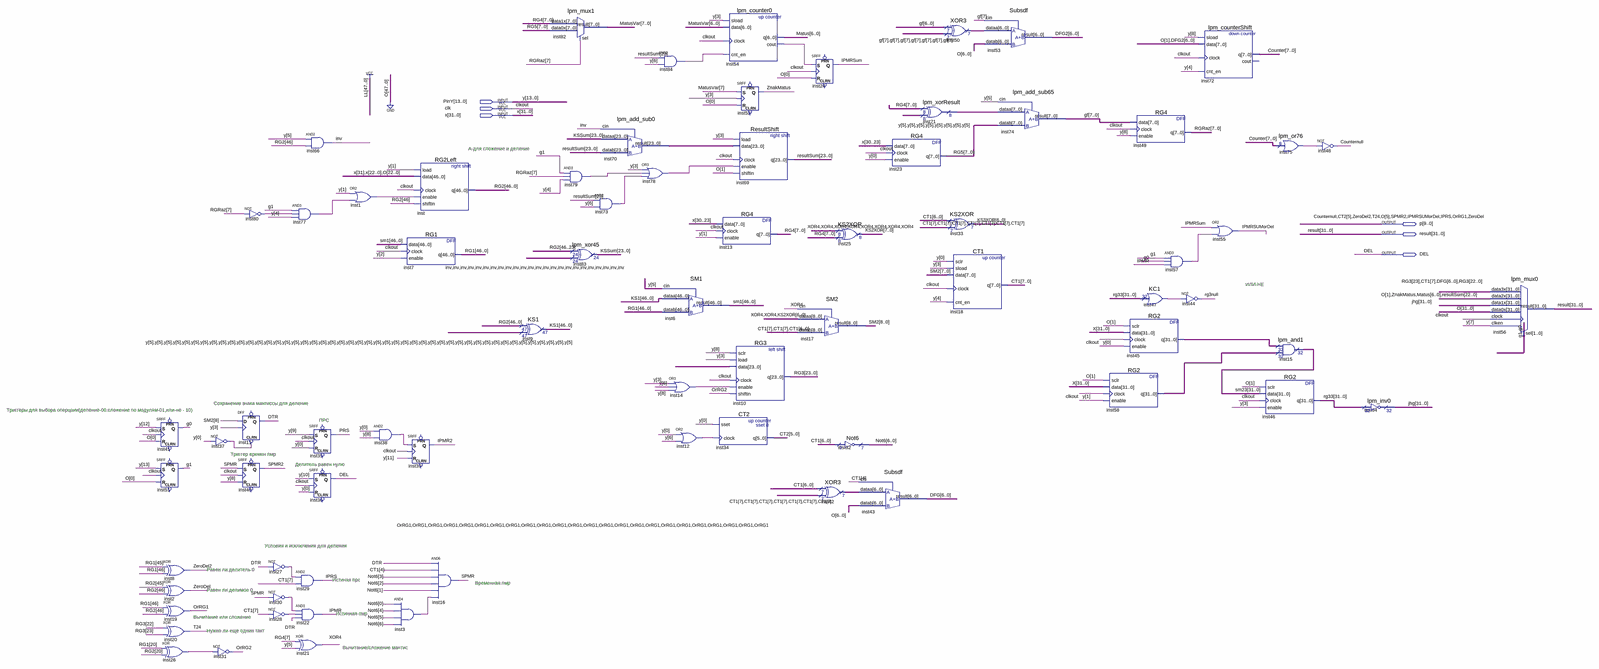
[diagram p0: schematic sheet, whole]
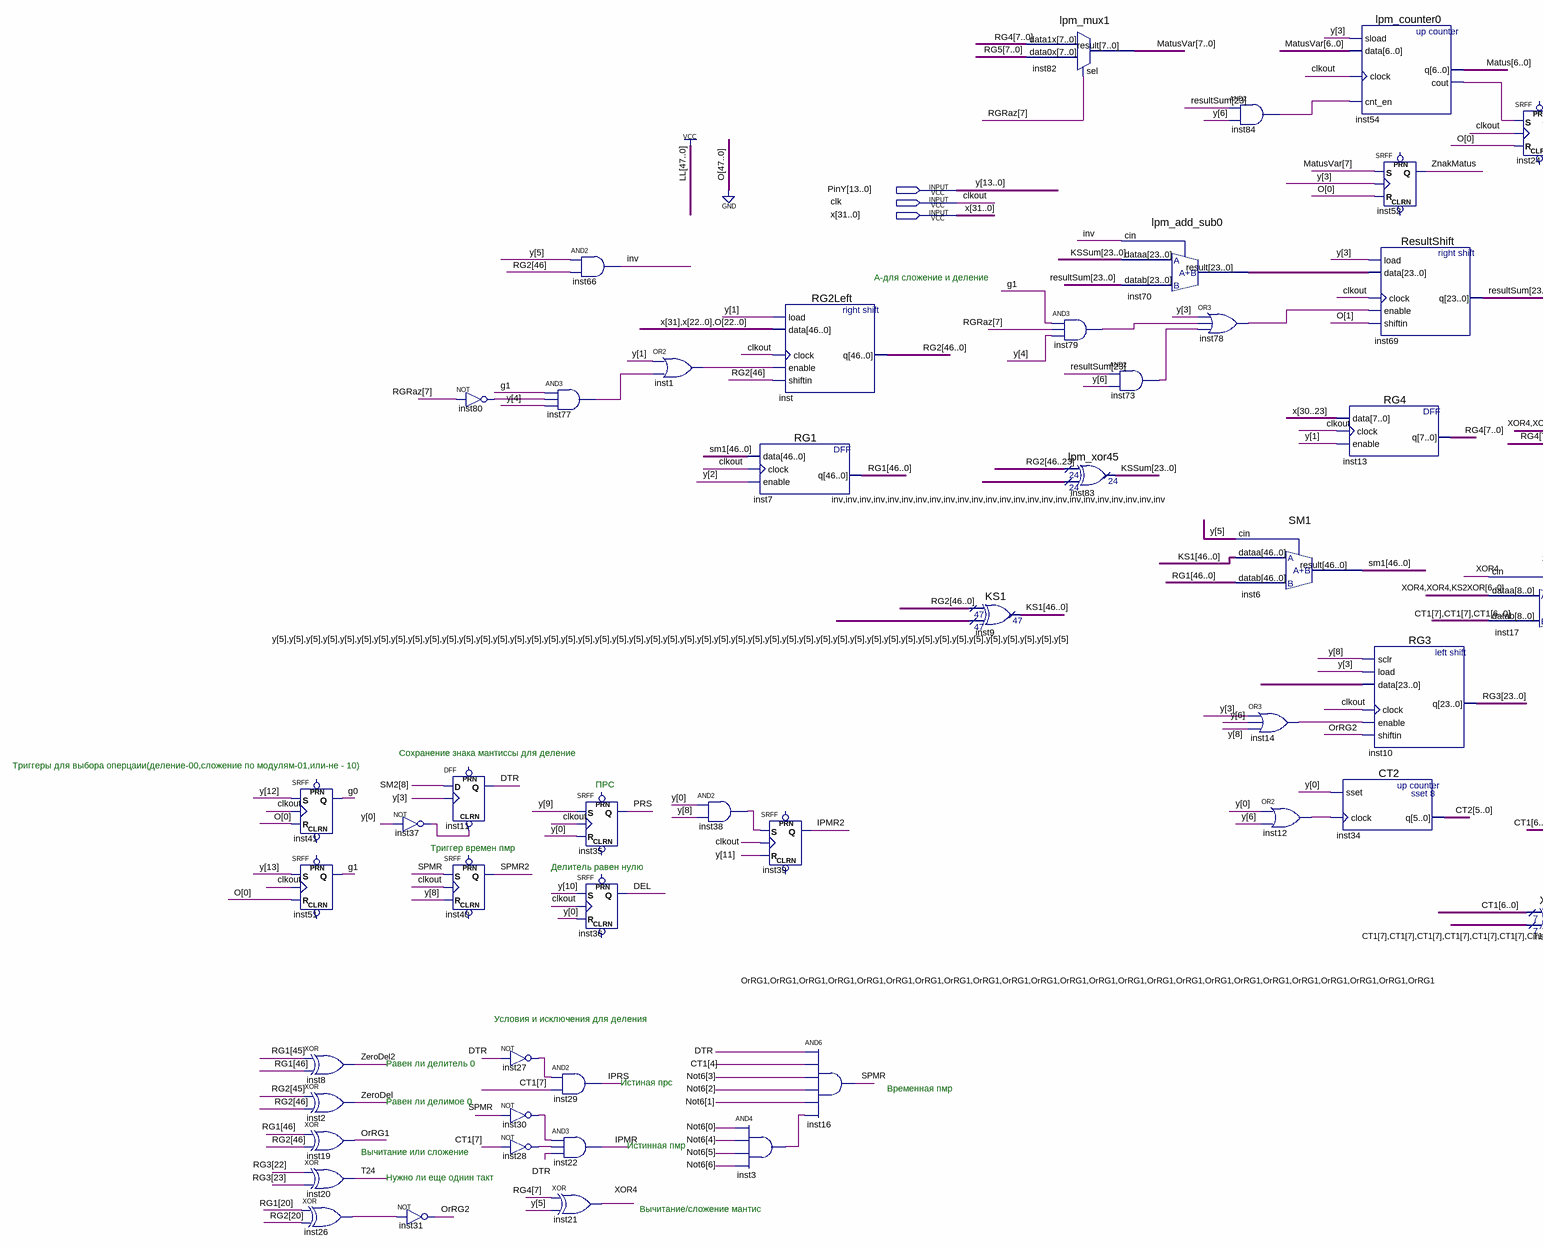
[diagram p1: schematic sheet, left part]
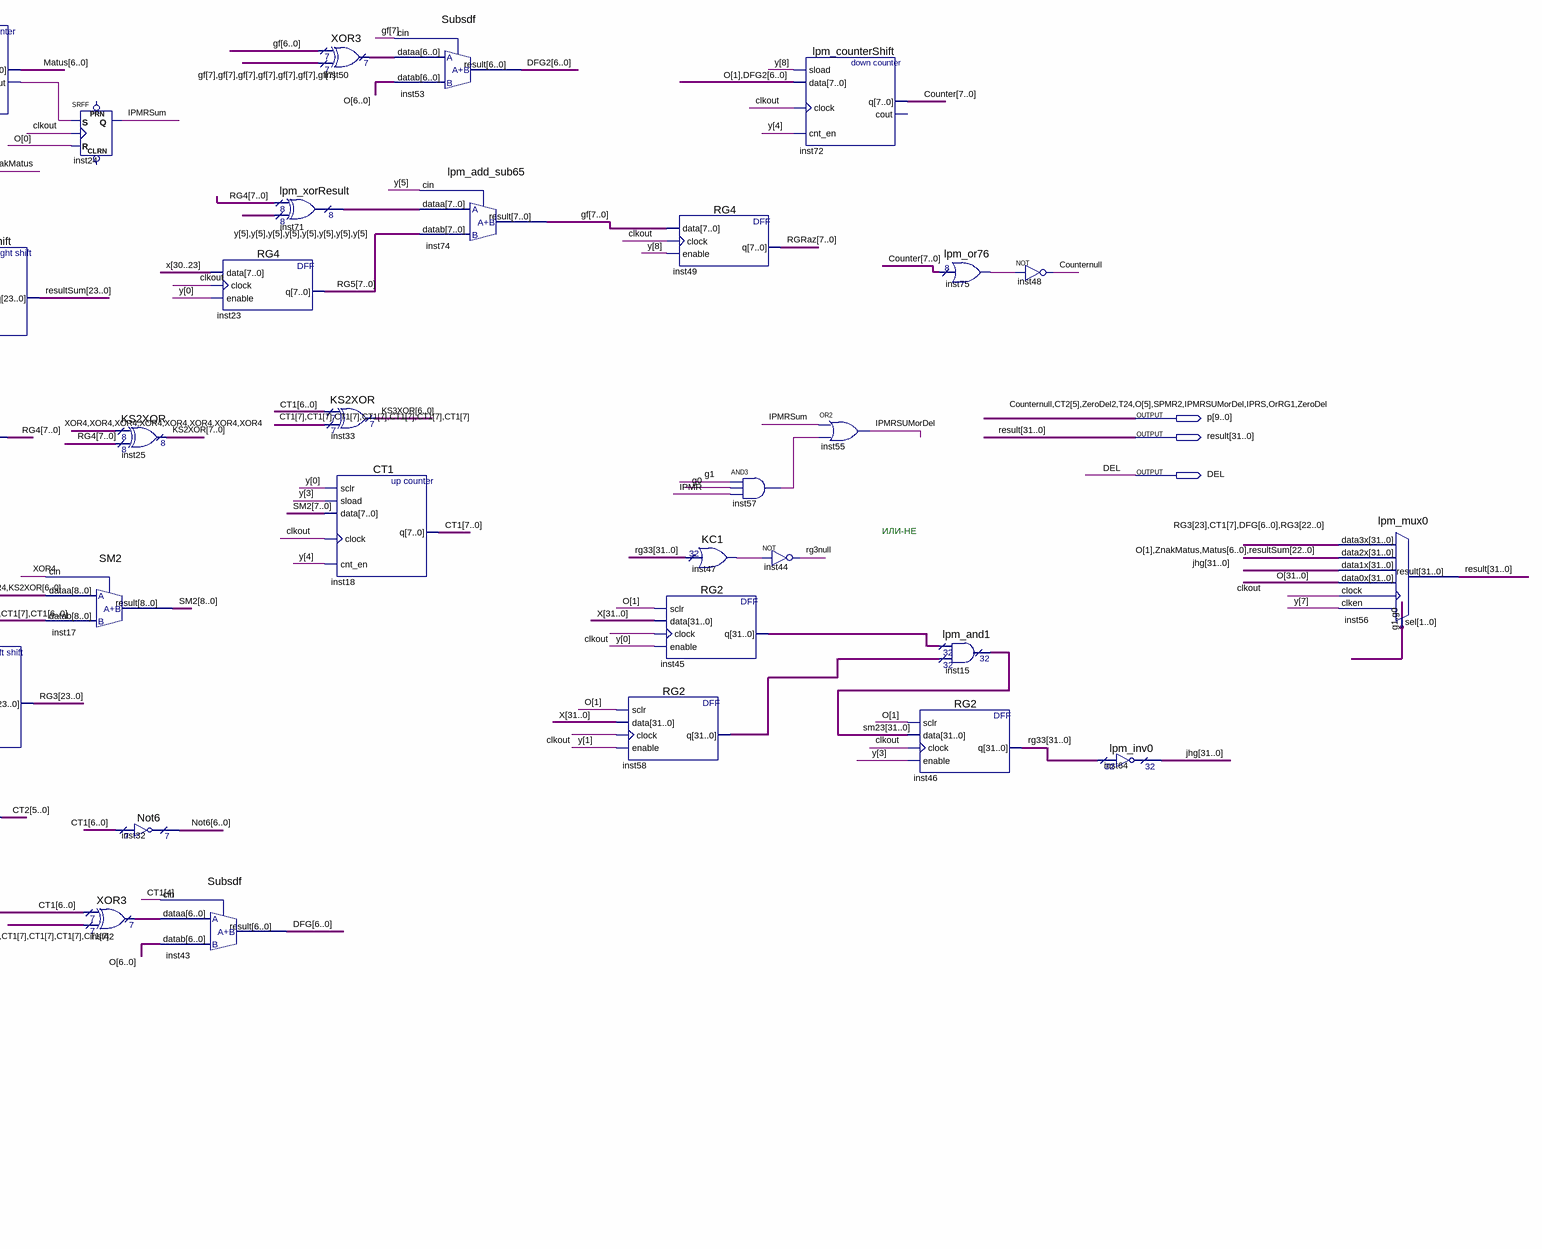
[diagram p2: schematic sheet, right part]
// Quartus schematic courseProject.bdf as structural Verilog: 73 symbols, 6 pins
module courseProject (
  input  [13:0] PinY,
  input  clk,
  input  [31:0] x,
  output [9:0] p,
  output [31:0] result,
  output DEL
);

  wire DTR, g0, g1, inst1_out, inst3_out, inst12_out, inst14_out, inst26_out, inst27_out, inst28_out,
       inst30_out, inst37_out, inst38_out, inst47_result, inst54_cout, inst57_out, inst73_out, inst75_result,
       inst77_out, inst78_out, inst79_out, inst80_out, inst84_out, inv, IPMR, IPMR2, IPMRSum, OrRG2, PRS,
       rg3null, SPMR, XOR4, ZnakMatus;
  wire [4:0] CT2;
  wire [6:0] DFG, DFG2, inst42_result, inst50_result, KS3XOR, Matus, Not6;
  wire [7:0] Counter, CT1, gf, inst71_result, KS2XOR, MatusVar, RG4, RG5, RGRaz;
  wire [8:0] SM2;
  wire [23:0] inst70_result, KSSum, resultSum, RG3;
  wire [31:0] inst45_q, inst58_q, jhg, rg33, sm23;
  wire [46:0] KS1, RG1, RG2, sm1;

  SRFF inst41 (.S(PinY[12]), .R(1'b0), .CLK(clk), .Q(g0));  // open: PRN, CLRN
  SRFF inst51 (.S(PinY[13]), .R(1'b0), .CLK(clk), .Q(g1));  // open: PRN, CLRN
  xor inst8 (p[7], RG1[45], RG1[46]);
  xor inst2 (p[0], RG2[45], RG2[46]);
  xor inst19 (p[1], RG1[46], RG2[46]);
  xor inst20 (p[6], RG3[22], RG3[23]);
  xor inst26 (inst26_out, RG1[20], RG2[20]);
  not inst37 (inst37_out, PinY[0]);
  not inst31 (OrRG2, inst26_out);
  not inst80 (inst80_out, RGRaz[7]);
  DFF inst11 (.CLRN(inst37_out), .CLK(PinY[3]), .D(SM2[8]), .Q(DTR));  // open: PRN
  SRFF inst40 (.S(SPMR), .R(PinY[8]), .CLK(clk), .Q(p[4]));  // open: PRN, CLRN
  not inst27 (inst27_out, DTR);
  not inst30 (inst30_out, SPMR);
  not inst28 (inst28_out, CT1[7]);
  and inst77 (inst77_out, g1, inst80_out, PinY[4]);
  and inst29 (p[2], inst27_out, CT1[7]);
  and inst22 (IPMR, inst30_out, inst28_out, DTR);
  xor inst21 (XOR4, RG4[7], PinY[5]);
  and inst66 (inv, PinY[5], RG2[46]);
  SRFF inst35 (.S(PinY[9]), .R(PinY[0]), .CLK(clk), .Q(PRS));  // open: PRN, CLRN
  SRFF inst36 (.S(PinY[10]), .R(PinY[0]), .CLK(clk), .Q(DEL));  // open: PRN, CLRN
  or inst1 (inst1_out, PinY[1], inst77_out);
  and inst38 (inst38_out, PinY[0], PinY[8]);
  RG1 inst7 (.data(sm1), .clock(clk), .enable(PinY[2]), .q(RG1));
  SRFF inst39 (.S(inst38_out), .R(PinY[11]), .CLK(clk), .Q(IPMR2));  // open: PRN, CLRN
  and inst3 (inst3_out, Not6[0], Not6[4], Not6[5], Not6[6]);
  RG2Left inst (
    .load(PinY[1]), .data({x[31], x[22:0], {23{1'b0}}}), .clock(clk), .enable(inst1_out), .shiftin(RG2[46]),
    .q(RG2));
  and inst16 (SPMR, DTR, CT1[4], Not6[3], Not6[2], Not6[1], inst3_out);
  KS1 inst9 (.data0x(RG2), .data1x({47{PinY[5]}}), .result(KS1));
  lpm_mux1 inst82 (.data1x(RG4), .data0x(RG5), .sel(RGRaz[7]), .result(MatusVar));
  and inst79 (inst79_out, g1, RGRaz[7], PinY[4]);
  lpm_xor45 inst83 (.data0x(RG2[46:23]), .data1x({24{inv}}), .result(KSSum));
  lpm_add_sub0 inst70 (.dataa(KSSum), .datab(resultSum), .cin(inv), .result(inst70_result));
  and inst73 (inst73_out, resultSum[23], PinY[6]);
  or inst78 (inst78_out, PinY[3], inst79_out, inst73_out);
  and inst84 (inst84_out, resultSum[23], PinY[6]);
  SM1 inst6 (.dataa(KS1), .datab(RG1), .cin(PinY[5]), .result(sm1));
  or inst14 (inst14_out, PinY[3], PinY[6], PinY[8]);
  or inst12 (inst12_out, PinY[0], PinY[6]);
  lpm_counter0 inst54 (
    .sload(PinY[3]), .data(MatusVar[6:0]), .clock(clk), .cnt_en(inst84_out), .q(Matus), .cout(inst54_cout));
  SRFF inst52 (.S(MatusVar[7]), .R(1'b0), .CLK(PinY[3]), .Q(ZnakMatus));  // open: PRN, CLRN
  ResultShift inst69 (
    .load(PinY[3]), .data(inst70_result), .clock(clk), .enable(inst78_out), .shiftin(1'b0), .q(resultSum));
  RG4 inst13 (.data(x[30:23]), .clock(clk), .enable(PinY[1]), .q(RG4));
  RG3 inst10 (
    .sclr(PinY[8]), .load(PinY[3]), .data({24{p[1]}}), .clock(clk), .enable(inst14_out), .shiftin(OrRG2),
    .q(RG3));
  CT2 inst34 (.sset(PinY[0]), .clock(inst12_out), .q({p[8], CT2}));
  SRFF inst24 (.S(inst54_cout), .R(1'b0), .CLK(clk), .Q(IPMRSum));  // open: PRN, CLRN
  SM2 inst17 (.dataa({{2{XOR4}}, KS2XOR[6:0]}), .datab({{2{CT1[7]}}, CT1[6:0]}), .cin(XOR4), .result(SM2));
  XOR3 inst42 (.data0x(CT1[6:0]), .data1x({7{CT1[7]}}), .result(inst42_result));
  KS2XOR inst25 (.data0x({8{XOR4}}), .data1x(RG4), .result(KS2XOR));
  Not6 inst32 (.data(CT1[6:0]), .result(Not6));
  Subsdf inst43 (.dataa(inst42_result), .datab({7{1'b0}}), .cin(CT1[4]), .result(DFG));
  RG4 inst23 (.data(x[30:23]), .clock(clk), .enable(PinY[0]), .q(RG5));
  lpm_xorResult inst71 (.data0x(RG4), .data1x({8{PinY[5]}}), .result(inst71_result));
  XOR3 inst50 (.data0x(gf[6:0]), .data1x({7{gf[7]}}), .result(inst50_result));
  KS2XOR inst33 (.data0x(CT1[6:0]), .data1x({7{CT1[7]}}), .result(KS3XOR));
  CT1 inst18 (.sclr(PinY[0]), .sload(PinY[3]), .data(SM2[7:0]), .clock(clk), .cnt_en(PinY[4]), .q(CT1));
  Subsdf inst53 (.dataa(inst50_result), .datab({7{1'b0}}), .cin(gf[7]), .result(DFG2));
  lpm_add_sub65 inst74 (.dataa(inst71_result), .datab(RG5), .cin(PinY[5]), .result(gf));
  RG2 inst58 (.sclr(1'b0), .data(x), .clock(clk), .enable(PinY[1]), .q(inst58_q));
  RG4 inst49 (.data(gf), .clock(clk), .enable(PinY[8]), .q(RGRaz));
  KC1 inst47 (.data(rg33), .result(inst47_result));
  RG2 inst45 (.sclr(1'b0), .data(x), .clock(clk), .enable(PinY[0]), .q(inst45_q));
  and inst57 (inst57_out, g1, g0, IPMR);
  lpm_counterShift inst72 (
    .sload(PinY[8]), .data({1'b0, DFG2}), .clock(clk), .cnt_en(PinY[4]), .q(Counter));  // open: cout
  not inst44 (rg3null, inst47_result);
  or inst55 (p[3], IPMRSum, inst57_out);
  lpm_or76 inst75 (.data(Counter), .result(inst75_result));
  lpm_and1 inst15 (.data0x(inst45_q), .data1x(inst58_q), .result(sm23));
  RG2 inst46 (.sclr(1'b0), .data(sm23), .clock(clk), .enable(PinY[3]), .q(rg33));
  not inst48 (p[9], inst75_result);
  lpm_inv0 inst64 (.data(rg33), .result(jhg));
  lpm_mux0 inst56 (
    .data3x({RG3[23], CT1[7], DFG, RG3[22:0]}), .data2x({1'b0, ZnakMatus, Matus, resultSum[22:0]}),
    .data1x(jhg), .data0x({32{1'b0}}), .clock(clk), .clken(PinY[7]), .sel({g1, g0}), .result(result));

  assign p[5] = 1'b0;

  // Other names for the same wires on the sheet: clkout = clk; Counternull = p[9]; CT2[5] = p[8]; IPMRSUMorDel = p[3];
  //   IPRS = p[2]; OrRG1 = p[1]; SPMR2 = p[4]; T24 = p[6]; y[13:0] = PinY; ZeroDel = p[0]; ZeroDel2 = p[7]

  // Notes on the sheet:
  //   A-для сложение и деление
  //   ИЛИ-НЕ
  //   Сохранение знака мантиссы для деление
  //   Триггеры для выбора оперцаии(деление-00,сложение по модулям-01,или-не - 10)
  //   ПРС
  //   Триггер времен пмр
  //   Делитель равен нулю
  //   Условия и исключения для деления
  //   Равен ли делитель 0
  //   Истиная прс
  //   Временная пмр
  //   Равен ли делимое 0
  //   Истинная пмр
  //   Вычитание или сложение
  //   Нужно ли еще однин такт
  //   Вычитание/сложение мантис
endmodule
